# Altium schematic sheet SW_PDA_DPNOx5_SMD.SCHDOC: PDA-Style 5 x DPNO Switch
size A4; Organization: Altium Limited.; Address1: Level 3, 12a Rodborough Rd; Address2: Frenchs Forest 2086; Address3: NSW; Address4: AUSTRALIA; SheetNumber: 1; SheetTotal: 100; PageSetup: Record=PageOptions|CenterHorizontal=True|CenterVertical=True|PrintScale=0.97|XCorrection=1.00|YCorrection=1.00|PrintKind=0|BorderSize=5000000|LeftOffset=0|BottomOffset=0|Orientation=2|PaperLength=1000|PaperWidth=1000|Scale=100|PaperSource=7|PrintQuality=-4|MediaType=1|DitherType=10|PaperKind=A4|PrintScaleMode=1
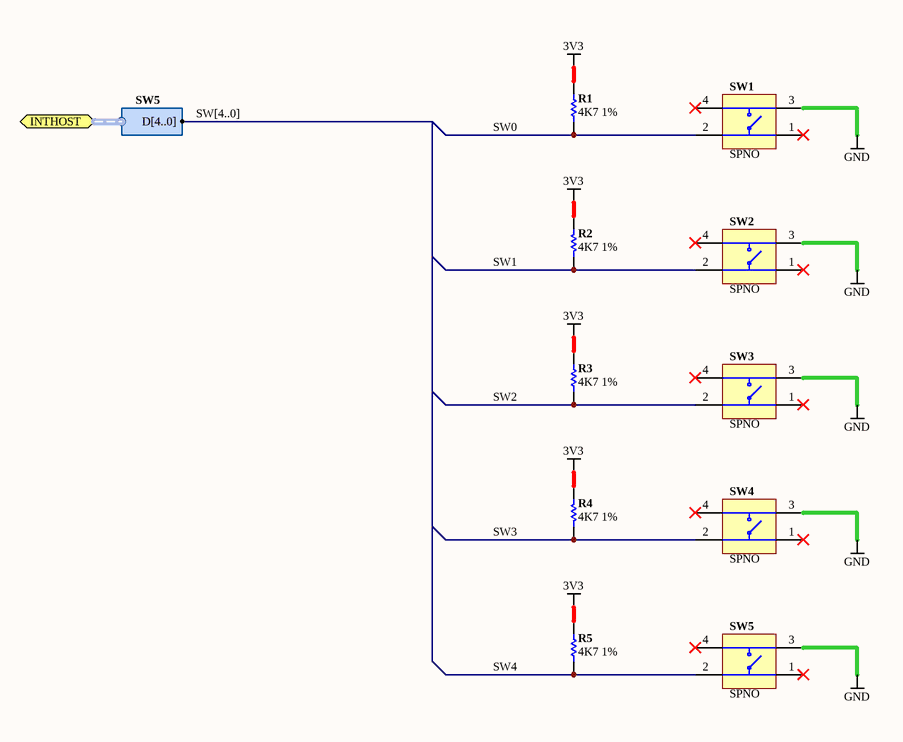
[diagram p0: SW_PDA_DPNOx5_SMD.SCHDOC]

## Parts
R1  4K7 1%  [RESC1005-STAR]
R2  4K7 1%  [RESC1005-STAR]
R3  4K7 1%  [RESC1005-STAR]
R4  4K7 1%  [RESC1005-STAR]
R5  4K7 1%  [RESC1005-STAR]
SW1  SPNO  [SW_DTSM-61NT/R]
SW2  SPNO  [SW_DTSM-61NT/R]
SW3  SPNO  [SW_DTSM-61NT/R]
SW4  SPNO  [SW_DTSM-61NT/R]
SW5  SPNO  [SW_DTSM-61NT/R]

## Ports
INTHOST (harness SW5)

## Harnesses
SW5: D[4..0]

## Nets
3V3: R1.1 R2.1 R3.2 R4.1 R5.2
GND: SW1.3 SW2.3 SW3.3 SW4.3 SW5.3
SW0: R1.2 SW1.2
SW1: R2.2 SW2.2
SW2: R3.1 SW3.2
SW3: R4.2 SW4.2
SW4: R5.1 SW5.2

Not connected (* = marked no-connect by the designer): SW1 1* 4*; SW2 1* 4*; SW3 1* 4*; SW4 1* 4*; SW5 1* 4*

## Buses and harness runs
bus SW[4..0]

## Notes on the sheet
- Sheet Title
- Project Title
- Size:
- Date:
- A4
- Assy:
- Time:
- Revision:
- Sheet
- of
- File:

## Library data of the parts
R1-R5 = D-100-0088: Resistor, 4K7 1% 0402 (1005); Power Rating: 63 mW; Resistance: 4.7 K; Category: Resistor; Mounting Technology: Surface Mount; Status: Production; Tolerance: 1 %
SW1-SW5 = D-301-0001: Switch, SPNO Push Button SMD; Rated Voltage: mV; Switch Type: SPDT; Category: Switch; Mounting Technology: Surface Mount; Status: Production